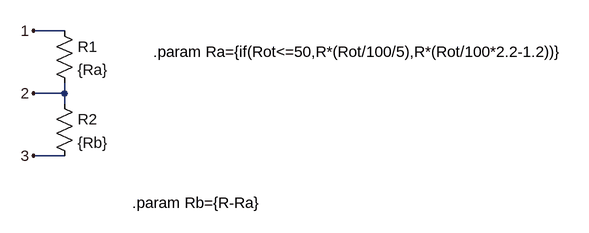
[diagram p0: schematic pot_log.asc]
pot_log.asc, the LTspice schematic file:
Version 4
SHEET 1 5632 1784
WIRE 608 -512 560 -512
WIRE 608 -416 608 -432
WIRE 608 -416 560 -416
WIRE 608 -400 608 -416
WIRE 608 -320 560 -320
FLAG 560 -512 1
FLAG 560 -416 2
FLAG 560 -320 3
SYMBOL res 592 -528 R0
SYMATTR InstName R1
SYMATTR Value {Ra}
SYMBOL res 592 -416 R0
SYMATTR InstName R2
SYMATTR Value {Rb}
TEXT 744 -480 Left 2 !.param Ra={if(Rot<=50,R*(Rot/100/5),R*(Rot/100*2.2-1.2))}
TEXT 712 -248 Left 2 !.param Rb={R-Ra}

The netlist it stands for:
* pot_log.asc
R1 1 2 {Ra}
R2 2 3 {Rb}
.param Ra={if(Rot<=50,R*(Rot/100/5),R*(Rot/100*2.2-1.2))}
.param Rb={R-Ra}
.backanno
.end